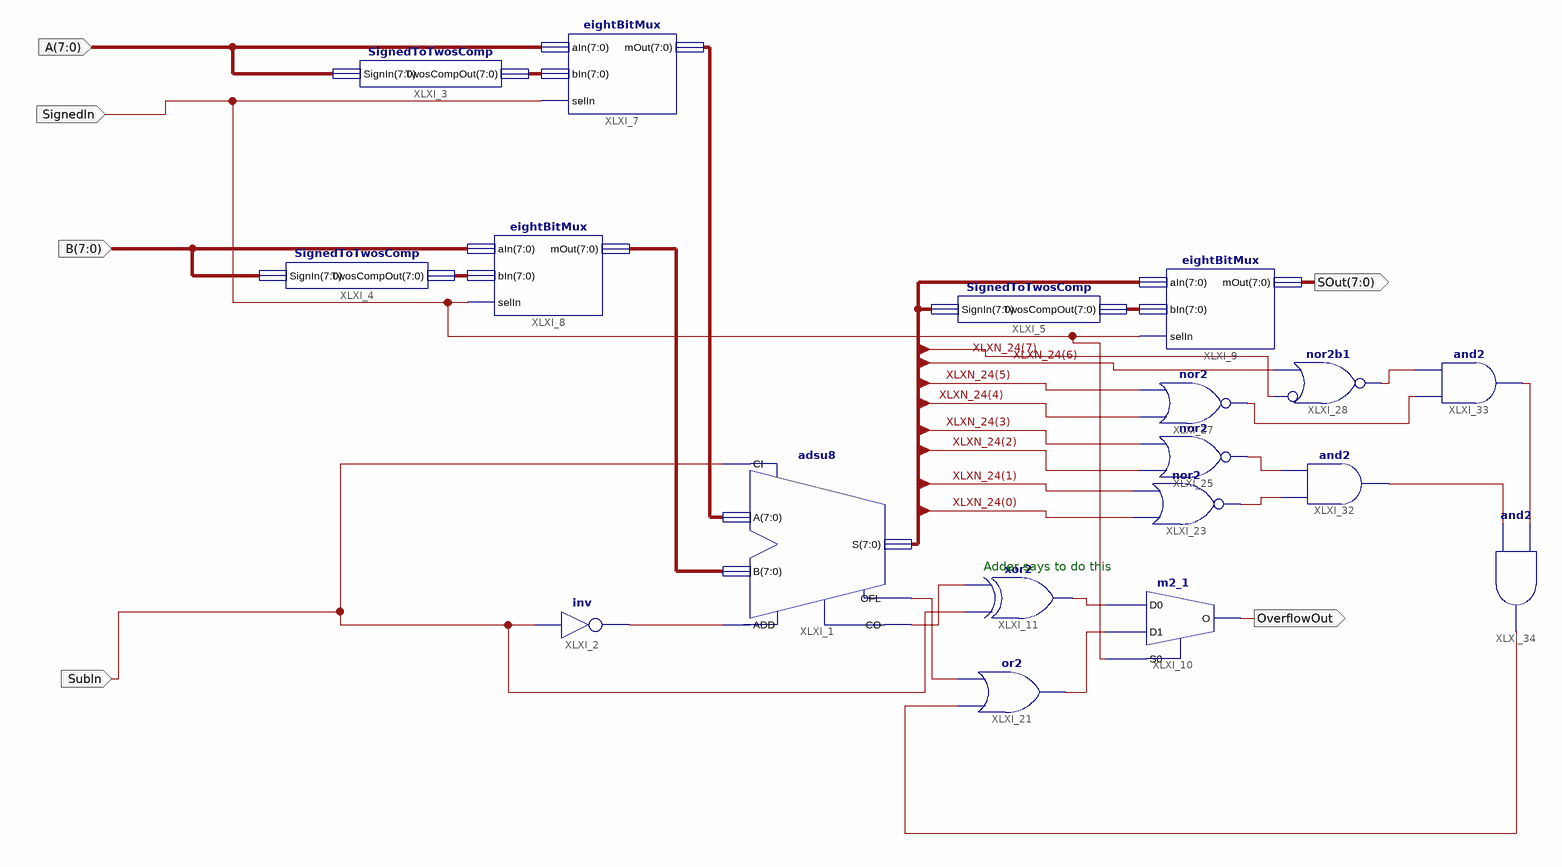
[diagram p0: schematic sheet 1]
// Xilinx ISE schematic ALUPico.sch (spartan3e) as structural Verilog: 18 symbols, 6 ports
module ALUPico (
  input  SignedIn,
  input  [7:0] A,
  input  [7:0] B,
  input  SubIn,
  output OverflowOut,
  output [7:0] SOut
);

  wire XLXN_6, XLXN_29, XLXN_30, XLXN_31, XLXN_43, XLXN_44, XLXN_45, XLXN_46, XLXN_47, XLXN_51, XLXN_53,
       XLXN_55;
  wire [7:0] XLXN_11, XLXN_12, XLXN_13, XLXN_22, XLXN_23, XLXN_24;

  SignedToTwosComp XLXI_3 (.SignIn(A), .TwosCompOut(XLXN_11));
  SignedToTwosComp XLXI_4 (.SignIn(B), .TwosCompOut(XLXN_12));
  SignedToTwosComp XLXI_5 (.SignIn(XLXN_24), .TwosCompOut(XLXN_13));
  not XLXI_2 (XLXN_6, SubIn);
  adsu8 XLXI_1 (.A(XLXN_23), .ADD(XLXN_6), .B(XLXN_22), .CI(SubIn), .CO(XLXN_29), .OFL(XLXN_30), .S(XLXN_24));
  eightBitMux XLXI_7 (.aIn(A), .bIn(XLXN_11), .selIn(SignedIn), .mOut(XLXN_23));
  eightBitMux XLXI_8 (.aIn(B), .bIn(XLXN_12), .selIn(SignedIn), .mOut(XLXN_22));
  eightBitMux XLXI_9 (.aIn(XLXN_24), .bIn(XLXN_13), .selIn(SignedIn), .mOut(SOut));
  m2_1 XLXI_10 (.D0(XLXN_31), .D1(XLXN_53), .S0(SignedIn), .O(OverflowOut));
  xor XLXI_11 (XLXN_31, SubIn, XLXN_29);
  or XLXI_21 (XLXN_53, XLXN_55, XLXN_30);
  nor XLXI_23 (XLXN_46, XLXN_24[0], XLXN_24[1]);
  nor XLXI_25 (XLXN_45, XLXN_24[2], XLXN_24[3]);
  nor XLXI_27 (XLXN_44, XLXN_24[4], XLXN_24[5]);
  nor XLXI_28 (XLXN_43, ~XLXN_24[7], XLXN_24[6]);  // nor2b1
  and XLXI_32 (XLXN_47, XLXN_46, XLXN_45);
  and XLXI_33 (XLXN_51, XLXN_44, XLXN_43);
  and XLXI_34 (XLXN_55, XLXN_47, XLXN_51);

  // Notes on the sheet:
  //   Adder says to do this
endmodule
